# EAGLE design DB23 to VGA (EAGLE 7.5.0)
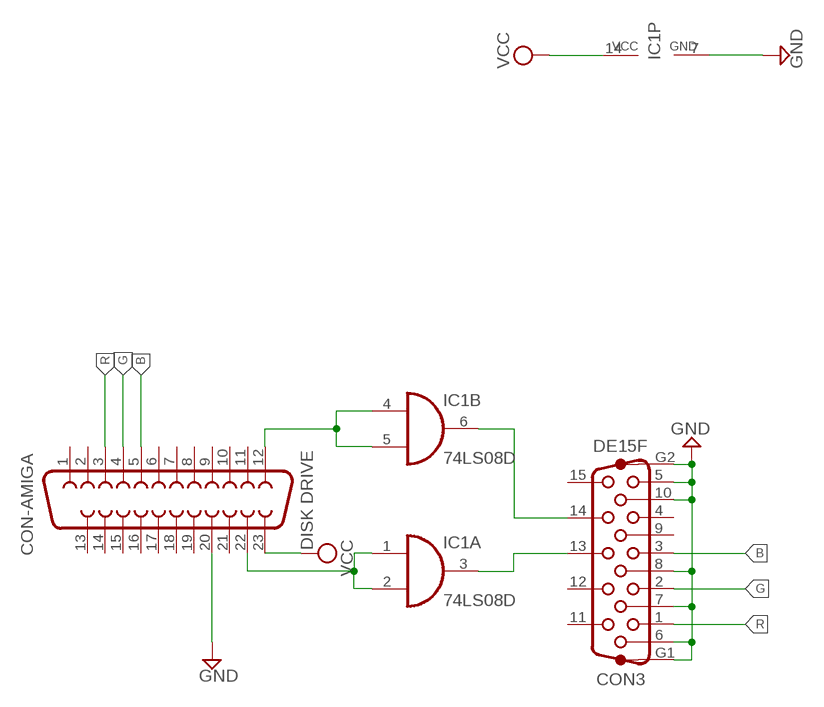
[diagram p0: schematic, sheet 1]

## Parts
CON3  DE15F  VGA-FHP  [VGA-FHP]
CON-AMIGA  DISK DRIVE  DB23  [DB23]
IC1  74LS08D  [SO14]

## Nets
B: CON3.3 CON-AMIGA.5
G: CON3.2 CON-AMIGA.4
GND: CON3.5 CON3.6 CON3.7 CON3.8 CON3.10 CON3.G1 CON3.G2 CON-AMIGA.20 IC1.7(P:GND)
N$2: CON3.13 IC1.3(A:O)
N$3: CON-AMIGA.12 IC1.4(B:I0) IC1.5(B:I1)
N$4: CON3.14 IC1.6(B:O)
N$5: CON-AMIGA.22 IC1.1(A:I0) IC1.2(A:I1)
R: CON3.1 CON-AMIGA.3
VCC: CON-AMIGA.23 IC1.14(P:VCC)
Unconnected: CON3.4 CON3.9 CON3.11 CON3.12 CON3.15 CON-AMIGA.1 CON-AMIGA.2 CON-AMIGA.6 CON-AMIGA.7 CON-AMIGA.8 CON-AMIGA.9 CON-AMIGA.10 CON-AMIGA.11 CON-AMIGA.13 CON-AMIGA.14 CON-AMIGA.15 CON-AMIGA.16 CON-AMIGA.17 CON-AMIGA.18 CON-AMIGA.19 CON-AMIGA.21 IC1.8(C:O) IC1.9(C:I0) IC1.10(C:I1) IC1.11(D:O) IC1.12(D:I0) IC1.13(D:I1)

## Library data of the parts
CON3 = _my:VGA-FHP
CON-AMIGA = _my:DB23
IC1 = 74xx-eu:74*08: Quad 2-input AND gate

## Board
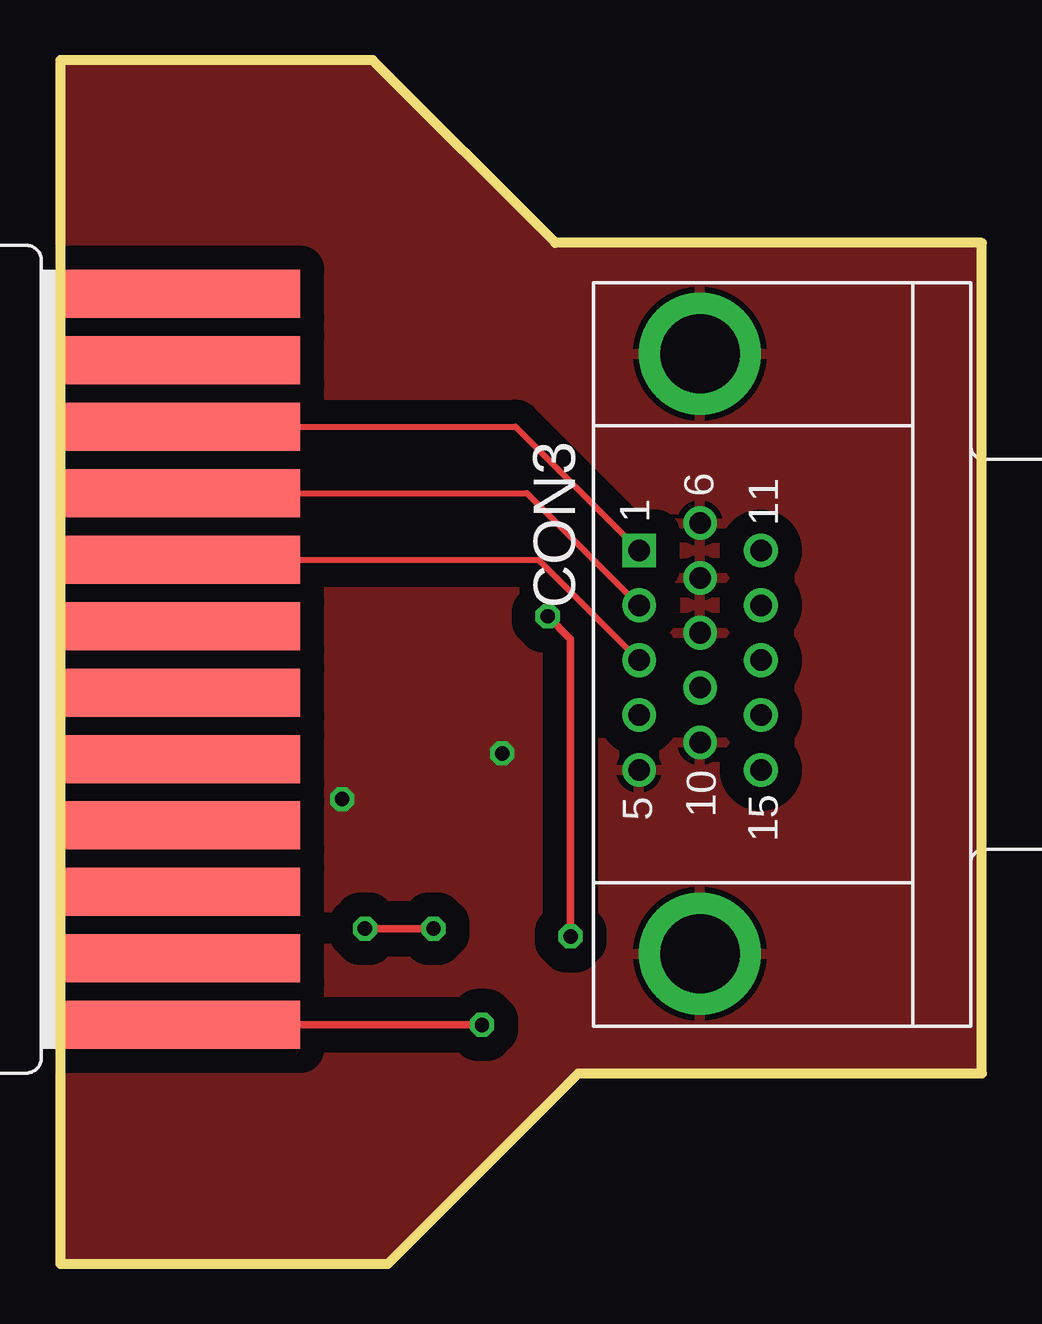
[diagram p1: board, top side]
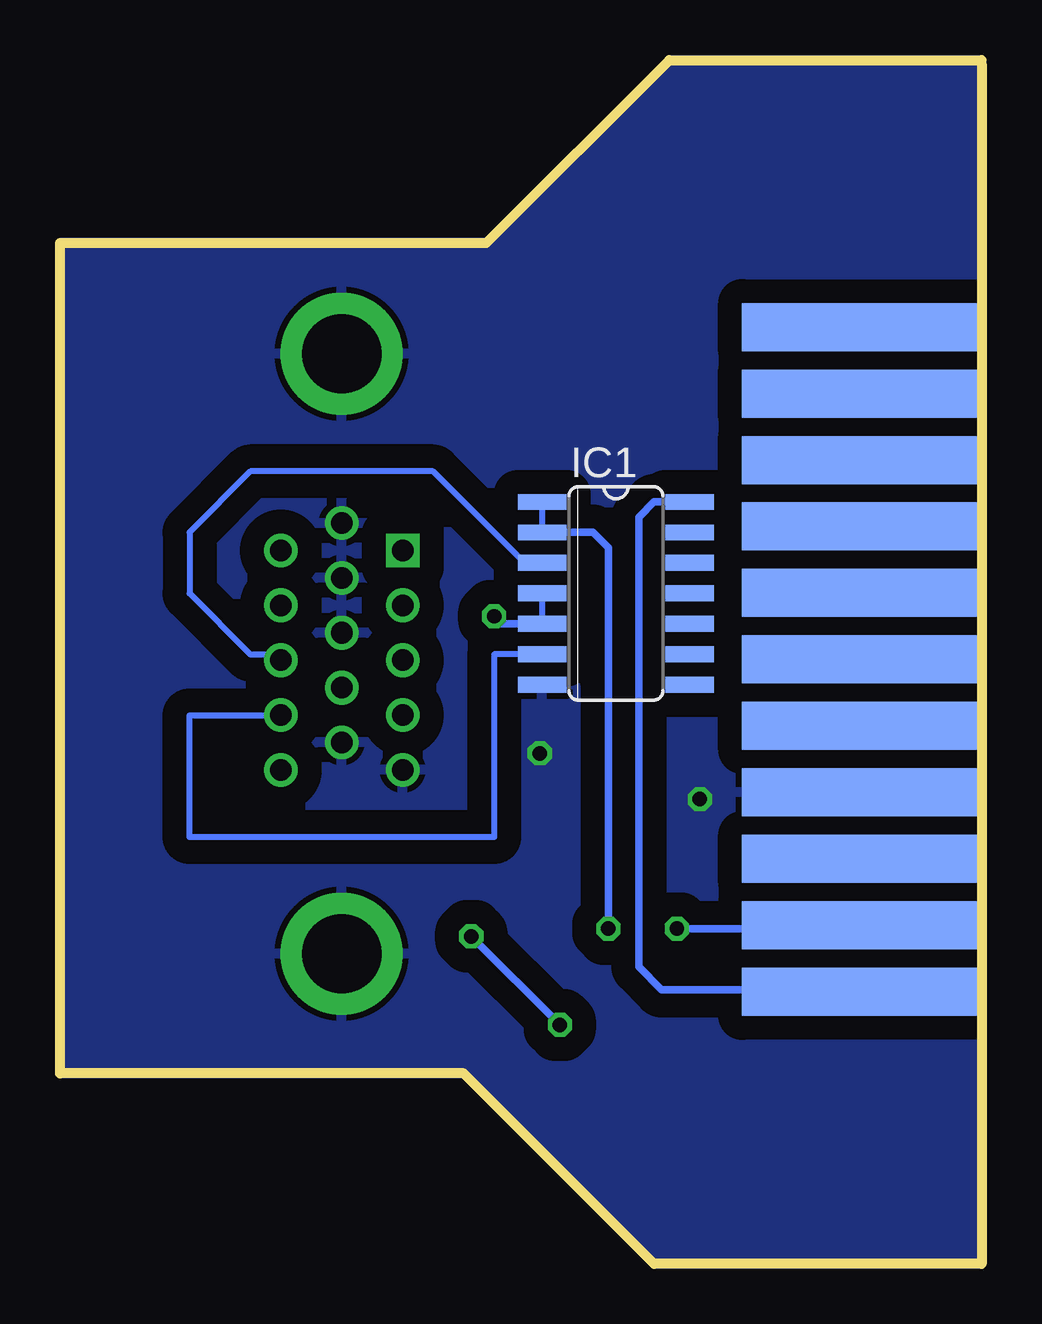
[diagram p2: board, bottom side, seen from below]

Size 38.42 x 50.16 mm. Coordinates in mm from the lower left corner, seen from the top.
Outline: 0,50 0,0 13.65,0 21.59,7.94 38.42,7.94 38.42,42.55 20.64,42.55 13.02,50.16 0,50.16
Copper layers (1*16): Top 0.035mm / dielectric 0.83mm / Bottom 0.035mm
Design rules "_my": minimum track width 1mm, minimum drill 24mil, track to track 1mm, track to pad 1mm, pad to pad 1mm, via to via 1mm, smd to smd 1mm, copper to edge 0mil, drill to drill 8mil, minimum pad ring 10mil, minimum via ring 8mil, stop-mask expansion 4mil, vias tented up to drill 0mil, thermal gap 10mil

### Footprints (pad centres in the part's own frame; a part is rotated, then mirrored left to right if it is on the bottom)
VGA-FHP = drill 0.9 square: 1 -4.329,-11.43 | drill 0.9: 2 -2.043,-11.43; 3 0.243,-11.43; 4 2.529,-11.43; 5 4.815,-11.43; 6 -5.472,-8.89; 7 -3.186,-8.89; 8 -0.9,-8.89; 9 1.386,-8.89; 10 3.672,-8.89; 11 -4.329,-6.35; 12 -2.043,-6.35; 13 0.243,-6.35; 14 2.529,-6.35; 15 4.815,-6.35 | drill 3.302 pad 5.08: G1 -12.52,-8.89; G2 12.48,-8.89
DB23 = smd 2 x 10: 1 15.23,-9.6; 2 12.46,-9.6; 3 9.69,-9.6; 4 6.92,-9.6; 5 4.15,-9.6; 6 1.38,-9.6; 7 -1.39,-9.6; 8 -4.16,-9.6; 9 -6.93,-9.6; 10 -9.7,-9.6; 11 -12.47,-9.6; 12 -15.24,-9.6 | smd 2 x 10 bottom: 13 13.838,-9.585; 14 11.068,-9.585; 15 8.298,-9.585; 16 5.528,-9.585; 17 2.758,-9.585; 18 -0.012,-9.585; 19 -2.782,-9.585; 20 -5.552,-9.585; 21 -8.322,-9.585; 22 -11.092,-9.585; 23 -13.862,-9.585
SO14 = smd 0.66 x 2.032: 1 -3.81,-3.073; 2 -2.54,-3.073; 3 -1.27,-3.073; 4 0,-3.073; 5 1.27,-3.073; 6 2.54,-3.073; 7 3.81,-3.073; 8 3.81,3.073; 9 2.54,3.073; 10 1.27,3.073; 11 0,3.073; 12 -1.27,3.073; 13 -2.54,3.073; 14 -3.81,3.073

### Placement (x,y rotation side)
CON3  35.56,25.4 270 top
CON-AMIGA  -4.6,25.2 90 top
IC1  15.24,27.94 270 bottom

### Tracks (layer width: path | path; a pad name or v marks a point on that pad's centre or on a via)
B
  Top 0.254: CON-AMIGA.5 19.94,29.35 CON3.3
G
  Top 0.254: CON-AMIGA.4 19.45,32.12 CON3.2
GND  (via drill 0.6 pad 0.25)
  other vias: 11.75,19.37 18.41,21.27
  pour Top (isolate 0.305): 0.32,50.16 13.02,50.16 20.64,42.55 38.1,42.55 38.1,7.94 21.59,7.94 13.65,0.32 13.34,0 0,0 0,50.16
  pour Bottom (isolate 0.305): 0,50.16 12.7,50.16 13.02,50.16 20.64,42.55 38.42,42.55 38.42,7.94 21.59,7.94 13.65,0 0,0
N$2
  Bottom 0.254: IC1.3 19.05,29.21 22.86,33.02 30.48,33.02 33.02,30.48 33.02,27.94 30.48,25.4 29.45,25.4 CON3.13
N$3  (via drill 0.6 pad 0.25)
  Top 0.305: CON-AMIGA.12 17.14,9.96 v17.58,9.96 | v20.32,26.99 21.27,26.04 v21.27,13.65
  Bottom 0.254: IC1.4 IC1.5
  Bottom 0.305: IC1.5 20,26.67 v20.32,26.99 | v21.27,13.65 v17.58,9.96
N$4
  Bottom 0.254: IC1.6 20.32,25.4 20.32,17.78 33.02,17.78 33.02,22.86 CON3.14
N$5  (via drill 0.6 pad 0.25)
  Top 0.305: v15.56,13.97 v12.7,13.97
  Bottom 0.254: IC1.1 IC1.2
  Bottom 0.305: IC1.2 16.19,30.48 15.56,29.84 v15.56,13.97 | v12.7,13.97 5.12,13.97 CON-AMIGA.22
R
  Top 0.254: CON-AMIGA.3 18.97,34.89 CON3.1
VCC
  Bottom 0.305: IC1.14 13.65,31.75 14.29,31.11 14.29,12.38 13.34,11.43 5.08,11.43 CON-AMIGA.23